# Altium schematic sheet MIXR UI.SchDoc
size B
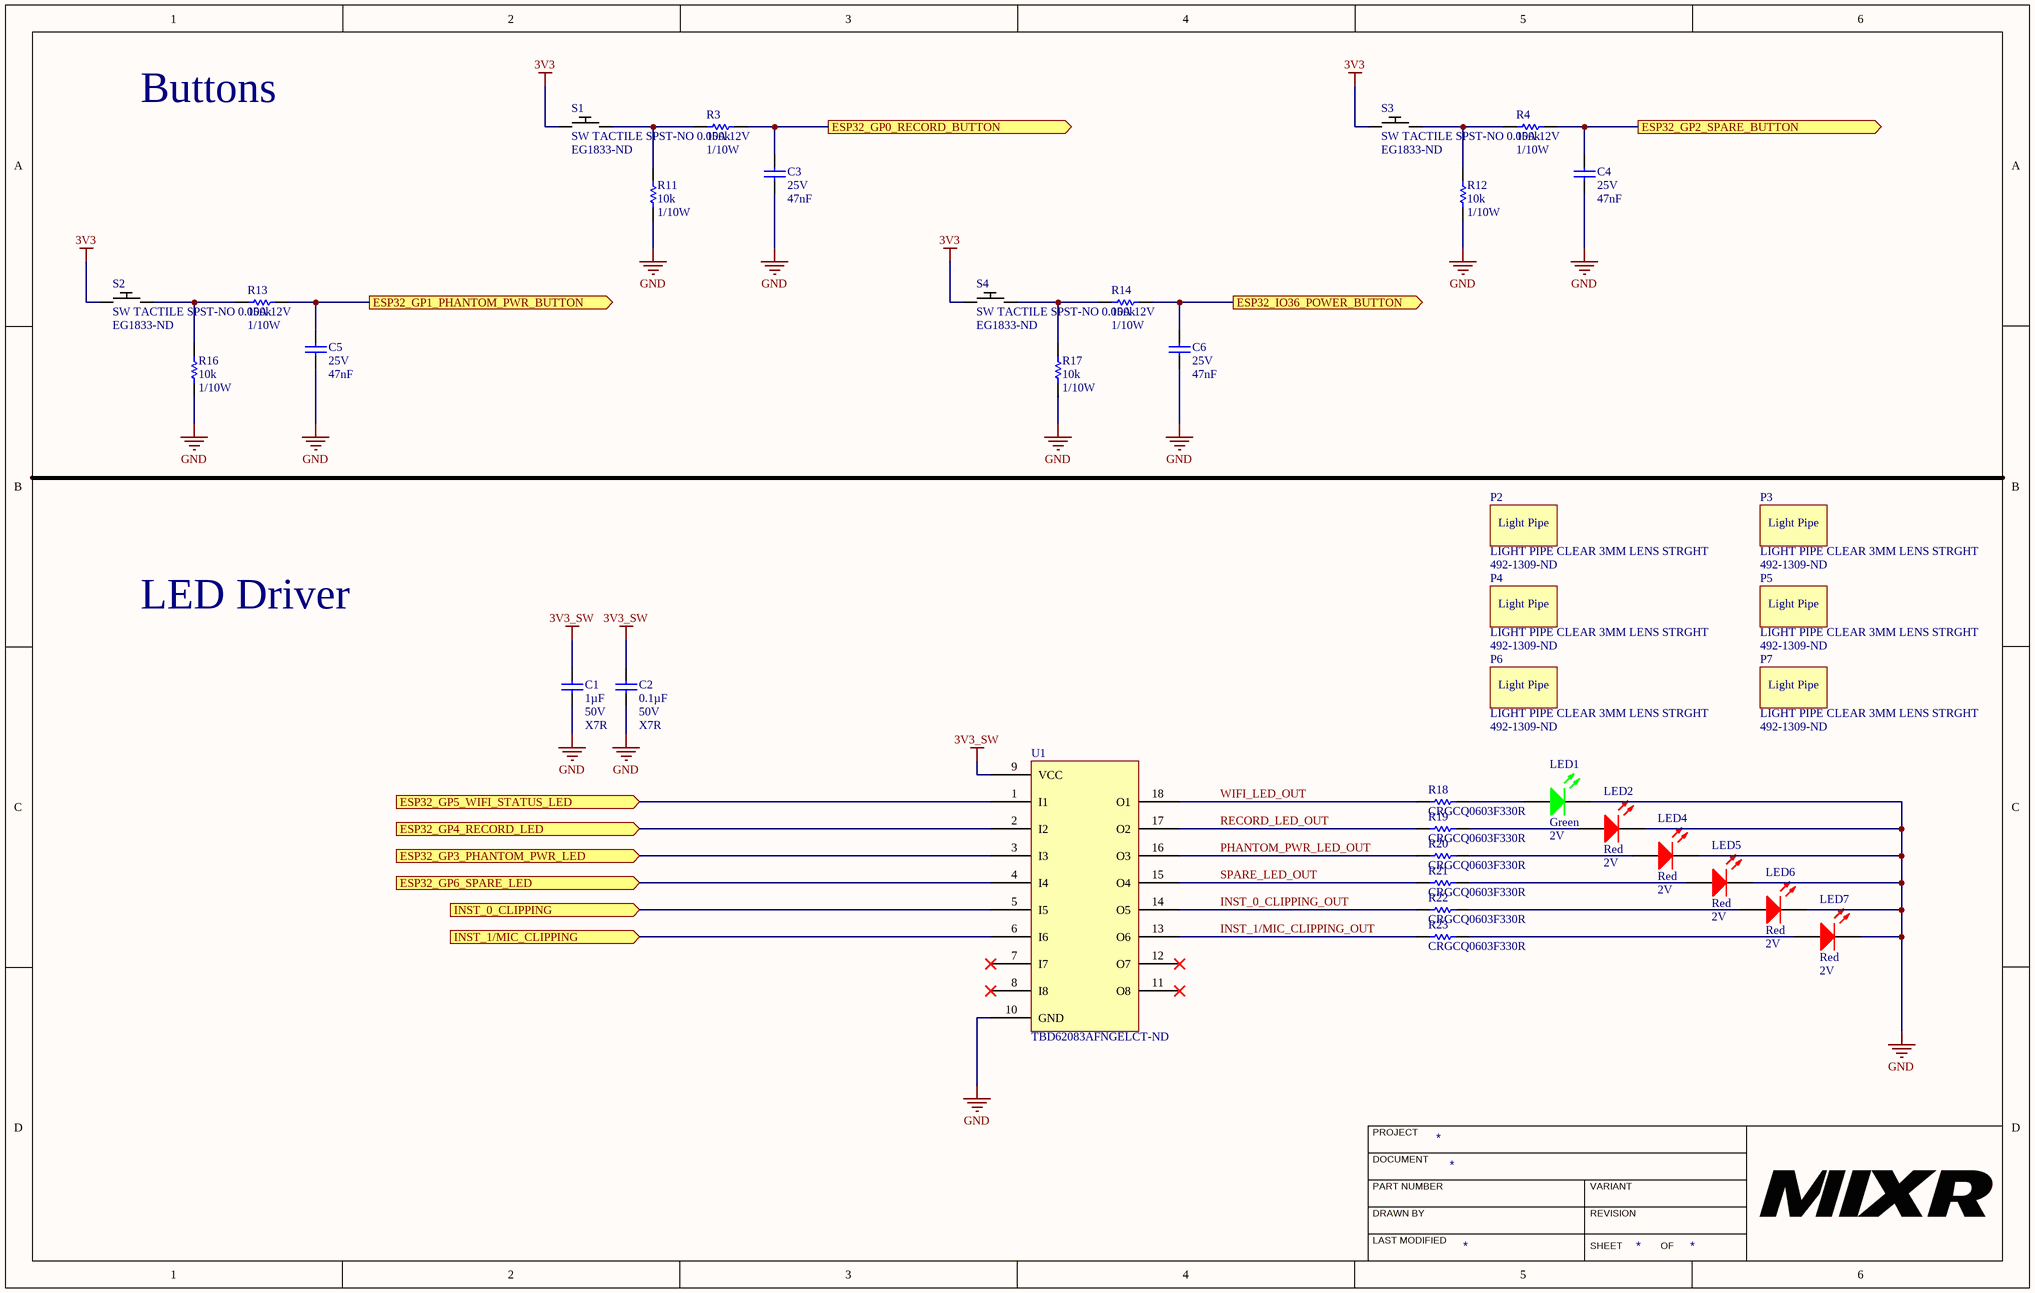
[diagram p0: MIXR UI.SchDoc]

## Parts
C1  Capacitance: 1µF  Voltage: 50V  Temperature Coefficient: X7R  [CAP, 0603]  (hidden comment: CAP CER 1UF 50V 10% X7R 0603)
C2  Capacitance: 0.1µF  Voltage: 50V  Temperature Coefficient: X7R  [CAP, 0603]  (hidden comment: CAP CER 0.1UF 50V 10% X7R 0603)
C3  Voltage: 25V  Capacitance: 47nF  [CAP, 0603]  (hidden comment: CAP CER 0.047UF 10% 25V X7R 0603)
C4  Voltage: 25V  Capacitance: 47nF  [CAP, 0603]  (hidden comment: CAP CER 0.047UF 10% 25V X7R 0603)
C5  Voltage: 25V  Capacitance: 47nF  [CAP, 0603]  (hidden comment: CAP CER 0.047UF 10% 25V X7R 0603)
C6  Voltage: 25V  Capacitance: 47nF  [CAP, 0603]  (hidden comment: CAP CER 0.047UF 10% 25V X7R 0603)
LED1  Color: Green  Voltage - Forward (Vf) (Typ): 2V  [LED_0603]  (hidden comment: LED GREEN CLEAR 2V 0603)
LED2  Color: Red  Voltage - Forward (Vf) (Typ): 2V  [LED_0603]  (hidden comment: LED RED CLEAR 2V 0603)
LED4  Color: Red  Voltage - Forward (Vf) (Typ): 2V  [LED_0603]  (hidden comment: LED RED CLEAR 2V 0603)
LED5  Color: Red  Voltage - Forward (Vf) (Typ): 2V  [LED_0603]  (hidden comment: LED RED CLEAR 2V 0603)
LED6  Color: Red  Voltage - Forward (Vf) (Typ): 2V  [LED_0603]  (hidden comment: LED RED CLEAR 2V 0603)
LED7  Color: Red  Voltage - Forward (Vf) (Typ): 2V  [LED_0603]  (hidden comment: LED RED CLEAR 2V 0603)
P2  LIGHT PIPE CLEAR 3MM LENS STRGHT  Supplier Part Number 1: 492-1309-ND  [LIGHT PIPE CLEAR 3MM LENS STRGHT]
P3  LIGHT PIPE CLEAR 3MM LENS STRGHT  Supplier Part Number 1: 492-1309-ND  [LIGHT PIPE CLEAR 3MM LENS STRGHT]
P4  LIGHT PIPE CLEAR 3MM LENS STRGHT  Supplier Part Number 1: 492-1309-ND  [LIGHT PIPE CLEAR 3MM LENS STRGHT]
P5  LIGHT PIPE CLEAR 3MM LENS STRGHT  Supplier Part Number 1: 492-1309-ND  [LIGHT PIPE CLEAR 3MM LENS STRGHT]
P6  LIGHT PIPE CLEAR 3MM LENS STRGHT  Supplier Part Number 1: 492-1309-ND  [LIGHT PIPE CLEAR 3MM LENS STRGHT]
P7  LIGHT PIPE CLEAR 3MM LENS STRGHT  Supplier Part Number 1: 492-1309-ND  [LIGHT PIPE CLEAR 3MM LENS STRGHT]
R3  Resistance: 100k  Power: 1/10W  [RES, 0603]  (hidden comment: RES 100K OHM 5% 1/8W 0603)
R4  Resistance: 100k  Power: 1/10W  [RES, 0603]  (hidden comment: RES 100K OHM 5% 1/8W 0603)
R11  Resistance: 10k  Power: 1/10W  [RES, 0603]  (hidden comment: RES 10K OHM 1% 1/10W 0603)
R12  Resistance: 10k  Power: 1/10W  [RES, 0603]  (hidden comment: RES 10K OHM 1% 1/10W 0603)
R13  Resistance: 100k  Power: 1/10W  [RES, 0603]  (hidden comment: RES 100K OHM 5% 1/8W 0603)
R14  Resistance: 100k  Power: 1/10W  [RES, 0603]  (hidden comment: RES 100K OHM 5% 1/8W 0603)
R16  Resistance: 10k  Power: 1/10W  [RES, 0603]  (hidden comment: RES 10K OHM 1% 1/10W 0603)
R17  Resistance: 10k  Power: 1/10W  [RES, 0603]  (hidden comment: RES 10K OHM 1% 1/10W 0603)
R18  Manufacturer Part Number: CRGCQ0603F330R  [RES, 0603]  (hidden comment: RES 330 OHM 1% 1/10W 0603)
R19  Manufacturer Part Number: CRGCQ0603F330R  [RES, 0603]  (hidden comment: RES 330 OHM 1% 1/10W 0603)
R20  Manufacturer Part Number: CRGCQ0603F330R  [RES, 0603]  (hidden comment: RES 330 OHM 1% 1/10W 0603)
R21  Manufacturer Part Number: CRGCQ0603F330R  [RES, 0603]  (hidden comment: RES 330 OHM 1% 1/10W 0603)
R22  Manufacturer Part Number: CRGCQ0603F330R  [RES, 0603]  (hidden comment: RES 330 OHM 1% 1/10W 0603)
R23  Manufacturer Part Number: CRGCQ0603F330R  [RES, 0603]  (hidden comment: RES 330 OHM 1% 1/10W 0603)
S1  SW TACTILE SPST-NO 0.05A 12V  Supplier Part Number 1: EG1833-ND  [SW SPST-NO 6x6mm Via Hole]
S2  SW TACTILE SPST-NO 0.05A 12V  Supplier Part Number 1: EG1833-ND  [SW SPST-NO 6x6mm Via Hole]
S3  SW TACTILE SPST-NO 0.05A 12V  Supplier Part Number 1: EG1833-ND  [SW SPST-NO 6x6mm Via Hole]
S4  SW TACTILE SPST-NO 0.05A 12V  Supplier Part Number 1: EG1833-ND  [SW SPST-NO 6x6mm Via Hole]
U1  Supplier Part Number 1: TBD62083AFNGELCT-ND  [IC LOAD SWITCH 8CH 0.5A 18-SSOP]  (hidden comment: IC LOAD SWITCH 8CH 0.5A 18SSOP)

## Ports
ESP32_GP0_RECORD_BUTTON (out), ESP32_GP1_PHANTOM_PWR_BUTTON (out), ESP32_GP2_SPARE_BUTTON (out), ESP32_GP3_PHANTOM_PWR_LED (in), ESP32_GP4_RECORD_LED (in), ESP32_GP5_WIFI_STATUS_LED (in), ESP32_GP6_SPARE_LED (in), ESP32_IO36_POWER_BUTTON (out), INST_0_CLIPPING (in), INST_1/MIC_CLIPPING (in)

## Nets
3V3: S1.1 S2.1 S3.1 S4.1
3V3_SW: C1.1 C2.1 U1.9(VCC)
GND: C1.2 C2.2 C3.2 C4.2 C5.2 C6.2 LED1.2(K) LED2.2(K) LED4.2(K) LED5.2(K) LED6.2(K) LED7.2(K) R11.1 R12.1 R16.1 R17.1 U1.10(GND)
ESP32_GP0_RECORD_BUTTON: C3.1 R3.2 ; port ESP32_GP0_RECORD_BUTTON
ESP32_GP1_PHANTOM_PWR_BUTTON: C5.1 R13.2 ; port ESP32_GP1_PHANTOM_PWR_BUTTON
ESP32_GP2_SPARE_BUTTON: C4.1 R4.2 ; port ESP32_GP2_SPARE_BUTTON
ESP32_GP3_PHANTOM_PWR_LED: U1.3(I3) ; port ESP32_GP3_PHANTOM_PWR_LED
ESP32_GP4_RECORD_LED: U1.2(I2) ; port ESP32_GP4_RECORD_LED
ESP32_GP5_WIFI_STATUS_LED: U1.1(I1) ; port ESP32_GP5_WIFI_STATUS_LED
ESP32_GP6_SPARE_LED: U1.4(I4) ; port ESP32_GP6_SPARE_LED
ESP32_IO36_POWER_BUTTON: C6.1 R14.2 ; port ESP32_IO36_POWER_BUTTON
INST_0_CLIPPING: U1.5(I5) ; port INST_0_CLIPPING
INST_0_CLIPPING_OUT: R22.1 U1.14(O5)
INST_1/MIC_CLIPPING: U1.6(I6) ; port INST_1/MIC_CLIPPING
INST_1/MIC_CLIPPING_OUT: R23.1 U1.13(O6)
PHANTOM_PWR_LED_OUT: R20.1 U1.16(O3)
RECORD_LED_OUT: R19.1 U1.17(O2)
SPARE_LED_OUT: R21.1 U1.15(O4)
WIFI_LED_OUT: R18.1 U1.18(O1)
NetLED1_1: LED1.1(A) R18.2
NetLED2_1: LED2.1(A) R19.2
NetLED4_1: LED4.1(A) R20.2
NetLED5_1: LED5.1(A) R21.2
NetLED6_1: LED6.1(A) R22.2
NetLED7_1: LED7.1(A) R23.2
NetR3_1: R3.1 R11.2 S1.2
NetR4_1: R4.1 R12.2 S3.2
NetR13_1: R13.1 R16.2 S2.2
NetR14_1: R14.1 R17.2 S4.2

Not connected (* = marked no-connect by the designer): U1 7(I7)* 8(I8)* 11(O8)* 12(O7)*

## Notes on the sheet
- Buttons
- LED Driver
- PROJECT
- DOCUMENT
- DRAWN BY
- LAST MODIFIED
- PART NUMBER
- REVISION
- SHEET
- VARIANT
- OF
- (in symbol LIGHT PIPE CLEAR 3MM LENS STRGHT) Light Pipe

## Library data of the parts
C1 = CAP CER 1UF 50V 10% X7R 0603: 1µF ±10% 50V Ceramic Capacitor X7R 0603 (1608 Metric); Manufacturer 1: Taiyo Yuden; Manufacturer Part Number 1: UMK107AB7105KA-T; Supplier 1: Digi-Key; Supplier Part Number 1: 587-3247-1-ND; Packaging: Cut Tape (CT); Part Status: Active; Operating Temperature: -55°C ~ 125°C; Ratings: -; Mounting Type: Surface Mount, MLCC; Package / Case: 0603 (1608 Metric); Size / Dimension: 0.063" L x 0.031" W (1.60mm x 0.80mm); Height - Seated (Max): -; Thickness (Max): 0.037" (0.95mm); Lead Spacing: -; Lead Style: -; ComponentLink1URL: http://www.yuden.co.jp/productdata/catalog/en/mlcc_all_e.pdf; ComponentLink1Description: http://www.yuden.co.jp/productdata/catalog/en/mlcc_all_e.pdf; Tolerance: ±10%
C2 = CAP CER 0.1UF 50V 10% X7R 0603: 0.10µF ±10% 50V Ceramic Capacitor X7R 0603 (1608 Metric); Manufacturer 1: AVX Corporation; Manufacturer Part Number 1: 06035C104KAT2A; Supplier 1: Digi-Key; Supplier Part Number 1: 478-5052-1-ND; Packaging: Cut Tape (CT); Part Status: Active; Operating Temperature: -55°C ~ 125°C; Ratings: -; Mounting Type: Surface Mount, MLCC; Package / Case: 0603 (1608 Metric); Size / Dimension: 0.063" L x 0.032" W (1.60mm x 0.81mm); Height - Seated (Max): -; Thickness (Max): 0.035" (0.90mm); Lead Spacing: -; Lead Style: -; ComponentLink1URL: http://datasheets.avx.com/X7RDielectric.pdf; ComponentLink1Description: http://datasheets.avx.com/X7RDielectric.pdf; Tolerance: ±10%
C3-C6 = CAP CER 0.047UF 10% 25V X7R 0603: 0.047µF ±10% 25V Ceramic Capacitor X7R 0603 (1608 Metric) /; Manufacturer: KEMET; Manufacturer Part Number: C0603C473K3RACTU; Supplier 1: Digi-Key; Supplier Part Number 1: 399-7931-1-ND; Stock 1: 1163581; Pricing 1: 1 = 0.11000, 10 = 0.07800, 100 = 0.03650, 500 = 0.02562, 1000 = 0.02121 (USD); RoHS: Yes; Mount: Surface Mount; Case/Package: 0603; Dielectric Material: Ceramic; Contact Plating: Tin; Min Operating Temperature: -55°C; Max Operating Temperature: 125°C; Tolerance: 10%; Packaging: Tape and Reel; Dielectric: X7R; Termination: SMD/SMT; Voltage Rating (DC): 25V; Length: 1.6mm; Height: 0.8mm; Depth: 0.8mm; Radiation Hardening: No; ComponentLink1URL: https://datasheet.ciiva.com/28682/1851736-28682293.pdf?src-supplier=Element14; ComponentLink1Description: https://datasheet.ciiva.com/28682/1851736-28682293.pdf?src-supplier=Element14; ComponentLink2URL: https://datasheet.ciiva.com/28584/1918693-28584138.pdf?src-supplier=Element14; ComponentLink2Description: https://datasheet.ciiva.com/28584/1918693-28584138.pdf?src-supplier=Element14; ComponentLink3URL: https://datasheet.ciiva.com/46445/1851736-46445227.pdf?src-supplier=Element14; ComponentLink3Description: https://datasheet.ciiva.com/46445/1851736-46445227.pdf?src-supplier=Element14; ComponentLink4URL: https://datasheet.ciiva.com/18193/getdatasheetpartid-330260-18193100.pdf?src-supplier=Verical; ComponentLink4Description: https://datasheet.ciiva.com/18193/getdatasheetpartid-330260-18193100.pdf?src-supplier=Verical; ComponentLink5URL: https://datasheet.ciiva.com/7824/kem-c1002-x7r-smd-7824045.pdf?src-supplier=Element14; ComponentLink5Description: https://datasheet.ciiva.com/7824/kem-c1002-x7r-smd-7824045.pdf?src-supplier=Element14
LED1 = LED GREEN CLEAR 2V 0603: Green 572nm LED Indication - Discrete 2V 0603 (1608 Metric); Manufacturer: Wurth Electronics Inc.; Manufacturer Part Number: 150060VS75000; Lens Color: Colorless; Millicandela Rating: 40mcd; Lens Style/Size: Rectangle with Flat Top, 1.10mm x 0.70mm; Current - Test: 20mA; Viewing Angle: 140°; Wavelength - Dominant: 570nm; Supplier 1: Digi-Key; RoHS: RoHS Compliant; Category: Optoelectronics; Stock 1: 9408; Pricing 1: 1=0.21, 100=0.1617, 500=0.13964 (CAD); Packaging: Cut Tape (CT); Part Status: Active; Lens Transparency: Clear; Mounting Type: Surface Mount; Wavelength - Peak: 572nm; Features: -; Package / Case: 0603 (1608 Metric); Supplier Device Package: 0603; Size / Dimension: 1.60mm L x 0.80mm W; Height (Max): 0.80mm; ComponentLink1URL: http://katalog.we-online.de/led/datasheet/150060VS75000.pdf; ComponentLink1Description: http://katalog.we-online.de/led/datasheet/150060VS75000.pdf; Supplier Part Number 1: 732-4980-1-ND
LED2 LED4-LED7 = LED RED CLEAR 2V 0603: Red 631nm LED Indication - Discrete 2V 0603 (1608 Metric); Manufacturer: Wurth Electronics Inc.; Manufacturer Part Number: 150060RS75000; Lens Color: Colorless; Millicandela Rating: 250mcd; Lens Style/Size: Rectangle with Flat Top, 1.10mm x 0.70mm; Current - Test: 20mA; Viewing Angle: 140°; Wavelength - Dominant: 625nm; Wavelength - Peak: 630nm; Supplier 1: Digi-Key; RoHS: RoHS Compliant; Category: Optoelectronics; Stock 1: 35521; Pricing 1: 1=0.21, 100=0.1617, 500=0.13964 (CAD); Packaging: Cut Tape (CT); Part Status: Active; Lens Transparency: Clear; Mounting Type: Surface Mount; Features: -; Package / Case: 0603 (1608 Metric); Supplier Device Package: 0603; Size / Dimension: 1.60mm L x 0.80mm W; Height (Max): 0.80mm; ComponentLink1URL: http://katalog.we-online.de/led/datasheet/150060RS75000.pdf; ComponentLink1Description: http://katalog.we-online.de/led/datasheet/150060RS75000.pdf; Supplier Part Number 1: 732-4978-1-ND
P2-P7 = LIGHT PIPE CLEAR 3MM LENS STRGHT: Light Pipe Single Clear Rigid Round with Flat Top, 3mm Panel Mount, Press Fit; Manufacturer: Bivar; Manufacturer Part Number: VLP-350-F; Number of Columns: 1; Supplier 1: Digi-Key; RoHS: Yes; Stock 1: 6661; Pricing 1: 1 = 0.52000, 10 = 0.40700, 100 = 0.26100, 500 = 0.22446, 1000 = 0.17330, 2500 = 0.15660, 5000 = 0.14616, 10000 = 0.14094, 25000 = 0.13920 (USD); Mount: Panel,Press-Fit,PCB; Case/Package: SMD/SMT; Color: Clear; Material: PC,Polycarbonate; Lens Color: Clear; Package Quantity: 100; Packaging: Bulk; Lens Style: Flat; Number of Rows: 1; Element Configuration: Single; Orientation: Straight; Length: 8.9mm; Lead Free: Lead Free; ComponentLink1URL: https://datasheet.ciiva.com/11770/0900766b80e77d26-11770547.pdf?src-supplier=RSComponents; ComponentLink1Description: https://datasheet.ciiva.com/11770/0900766b80e77d26-11770547.pdf?src-supplier=RSComponents; ComponentLink2URL: https://datasheet.ciiva.com/2142/vlp-xxx-x-2142655.pdf?src-supplier=Digi-Key; ComponentLink2Description: https://datasheet.ciiva.com/2142/vlp-xxx-x-2142655.pdf?src-supplier=Digi-Key
R3 R4 R13 R14 = RES 100K OHM 5% 1/8W 0603: RES SMD 100K OHM 5% 1/10W 0603; Manufacturer 1: Yageo; Manufacturer Part Number 1: RC0603JR-07100KL; Temperature Coefficient: ±100ppm/°C; Supplier 1: Digi-Key; Supplier Part Number 1: 311-100KGRCT-ND; Packaging: Cut Tape (CT); Part Status: Active; Composition: Thick Film; Operating Temperature: -55°C ~ 155°C; Package / Case: 0603 (1608 Metric); Supplier Device Package: 0603; Size / Dimension: 0.063" L x 0.031" W (1.60mm x 0.80mm); Height - Seated (Max): 0.022" (0.55mm); Failure Rate: -; ComponentLink1URL: http://www.yageo.com/documents/recent/PYu-RC_Group_51_RoHS_L_7.pdf; ComponentLink1Description: http://www.yageo.com/documents/recent/PYu-RC_Group_51_RoHS_L_7.pdf; Tolerance: ±5%
R11 R12 R16 R17 = RES 10K OHM 1% 1/10W 0603: RES SMD 10K OHM 1% 1/10W 0603; Manufacturer 1: Yageo; Manufacturer Part Number 1: RC0603FR-0710KL; Temperature Coefficient: ±100ppm/°C; Supplier 1: Digi-Key; Supplier Part Number 1: 311-10.0KHRCT-ND; Packaging: Cut Tape (CT); Part Status: Active; Composition: Thick Film; Operating Temperature: -55°C ~ 155°C; Package / Case: 0603 (1608 Metric); Supplier Device Package: 0603; Size / Dimension: 0.063" L x 0.031" W (1.60mm x 0.80mm); Height - Seated (Max): 0.022" (0.55mm); Failure Rate: -; ComponentLink1URL: http://www.yageo.com/documents/recent/PYu-RC_Group_51_RoHS_L_7.pdf; ComponentLink1Description: http://www.yageo.com/documents/recent/PYu-RC_Group_51_RoHS_L_7.pdf; Tolerance: ±1%
R18-R23 = RES 330 OHM 1% 1/10W 0603: 330 Ohms ±1% 0.1W, 1/10W Chip Resistor 0603 (1608 Metric) Automotive AEC-Q200, Moisture Resistant Thick Film; Manufacturer: TE Connectivity; Supplier 1: Digi-Key; Supplier Part Number 1: A129682CT-ND; RoHS: No; Stock 1: 87700; Pricing 1: 1 = 0.10000, 10 = 0.03300, 100 = 0.01320, 1000 = 0.00595, 2500 = 0.00516 (USD); ComponentLink1URL: http://www.te.com/commerce/DocumentDelivery/DDEController?Action=srchrtrv&DocNm=1773204-3&DocType=DS&DocLang=English&src-supplier=Digi-Key; ComponentLink1Description: http://www.te.com/commerce/DocumentDelivery/DDEController?Action=srchrtrv&DocNm=1773204-3&DocType=DS&DocLang=English&src-supplier=Digi-Key; ComponentLink2URL: https://www.te.com/commerce/DocumentDelivery/DDEController?Action=srchrtrv&DocNm=1773204-3&DocType=DS&DocLang=English&src-supplier=Digi-Key; ComponentLink2Description: https://www.te.com/commerce/DocumentDelivery/DDEController?Action=srchrtrv&DocNm=1773204-3&DocType=DS&DocLang=English&src-supplier=Digi-Key
S1-S4 = SW TACTILE SPST-NO 0.05A 12V: Tactile Switch SPST-NO Top Actuated Through Hole; Manufacturer: E-Switch; Manufacturer Part Number: TL1105BF160Q; Mechanical Life: 100000Cycles; Actuator Material: Nylon,Polyamide; Current Rating: 50mA; Operating Force: 160gf; Max Voltage Rating (DC): 50V; Contact Resistance: 100mR; Throw Configuration: SPST; Illumination Type: Non-Illuminated,Illuminated; Switch Travel: 0.25mm; Switch Function: Off-Mom; Actuator Type: Standard; Actuator Length: 5.9mm; Supplier 1: Digi-Key; RoHS: Yes; Stock 1: 31168; Pricing 1: 1 = 0.19000, 10 = 0.18800, 25 = 0.18200, 50 = 0.17540, 100 = 0.16560, 250 = 0.15584, 500 = 0.14936, 1000 = 0.11365, 5000 = 0.09416 (USD); Mount: Through Hole; Contact Plating: Silver; Contact Material: Silver,Bronze; Housing Material: Nylon; Min Operating Temperature: -20°C; Max Operating Temperature: 70°C; Package Quantity: 750; Voltage Rating (DC): 12V; Packaging: Bulk; Termination: PC Pin; Electrical Life: 100000Cycles; Orientation: Straight; Contact Current Rating: 50mA; Voltage Rating: 12V; Insulation Resistance: 100MR; Width: 6mm; REACH SVHC: No SVHC; Lead Free: Lead Free; ComponentLink1URL: https://datasheet.ciiva.com/16156/p010003-16156249.pdf?src-supplier=Onlinecomponents.com; ComponentLink1Description: https://datasheet.ciiva.com/16156/p010003-16156249.pdf?src-supplier=Onlinecomponents.com; ComponentLink2URL: https://datasheet.ciiva.com/2900/p010003-2900804.pdf?src-supplier=Digi-Key; ComponentLink2Description: https://datasheet.ciiva.com/2900/p010003-2900804.pdf?src-supplier=Digi-Key; ComponentLink3URL: https://datasheet.ciiva.com/7637/tl1105-7637643.pdf?src-supplier=Element14; ComponentLink3Description: https://datasheet.ciiva.com/7637/tl1105-7637643.pdf?src-supplier=Element14
U1 = IC LOAD SWITCH 8CH 0.5A 18SSOP: IC LOAD SWITCH 8CHANNEL 0.5A 18SSOP; Manufacturer: Toshiba; Manufacturer Part Number: TBD62083AFNG,EL; Number of Outputs: 8; Interface: On/Off; Output Configuration: Low Side; ComponentLink1URL: http://www.mouser.com/ds/2/408/TBD62783APG_datasheet_en_20160511-775715.pdf?src-supplier=Mouser; ComponentLink1Description: http://www.mouser.com/ds/2/408/TBD62783APG_datasheet_en_20160511-775715.pdf?src-supplier=Mouser; ComponentLink2URL: https://toshiba.semicon-storage.com/info/docget.jsp?did=30523&prodName=TBD62783AFG&src-supplier=Digi-Key; ComponentLink2Description: https://toshiba.semicon-storage.com/info/docget.jsp?did=30523&prodName=TBD62783AFG&src-supplier=Digi-Key; ComponentLink3URL: http://www.toshiba.semicon-storage.com/info/docget.jsp?did=14247&src-supplier=Digi-Key; ComponentLink3Description: http://www.toshiba.semicon-storage.com/info/docget.jsp?did=14247&src-supplier=Digi-Key; Supplier 1: Digi-Key; RoHS: Yes; Stock 1: 61183; Pricing 1: 1 = 0.78000, 10 = 0.68500, 25 = 0.60680, 100 = 0.52840, 250 = 0.45988, 500 = 0.39140, 1000 = 0.31312 (USD); Case/Package: LSSOP; Number of Pins: 18; Min Operating Temperature: -40°C; Max Operating Temperature: 85°C; Packaging: Tape and Reel; ComponentLink4URL: https://toshiba.semicon-storage.com/info/docget.jsp?did=29893&prodName=TBD62083AFG&src-supplier=Digi-Key; ComponentLink4Description: https://toshiba.semicon-storage.com/info/docget.jsp?did=29893&prodName=TBD62083AFG&src-supplier=Digi-Key